# Altium schematic sheet S4V_Robot_Brain_V2.0_Schematic.SchDoc
size A3; SheetNumber: 1; SheetTotal: 1
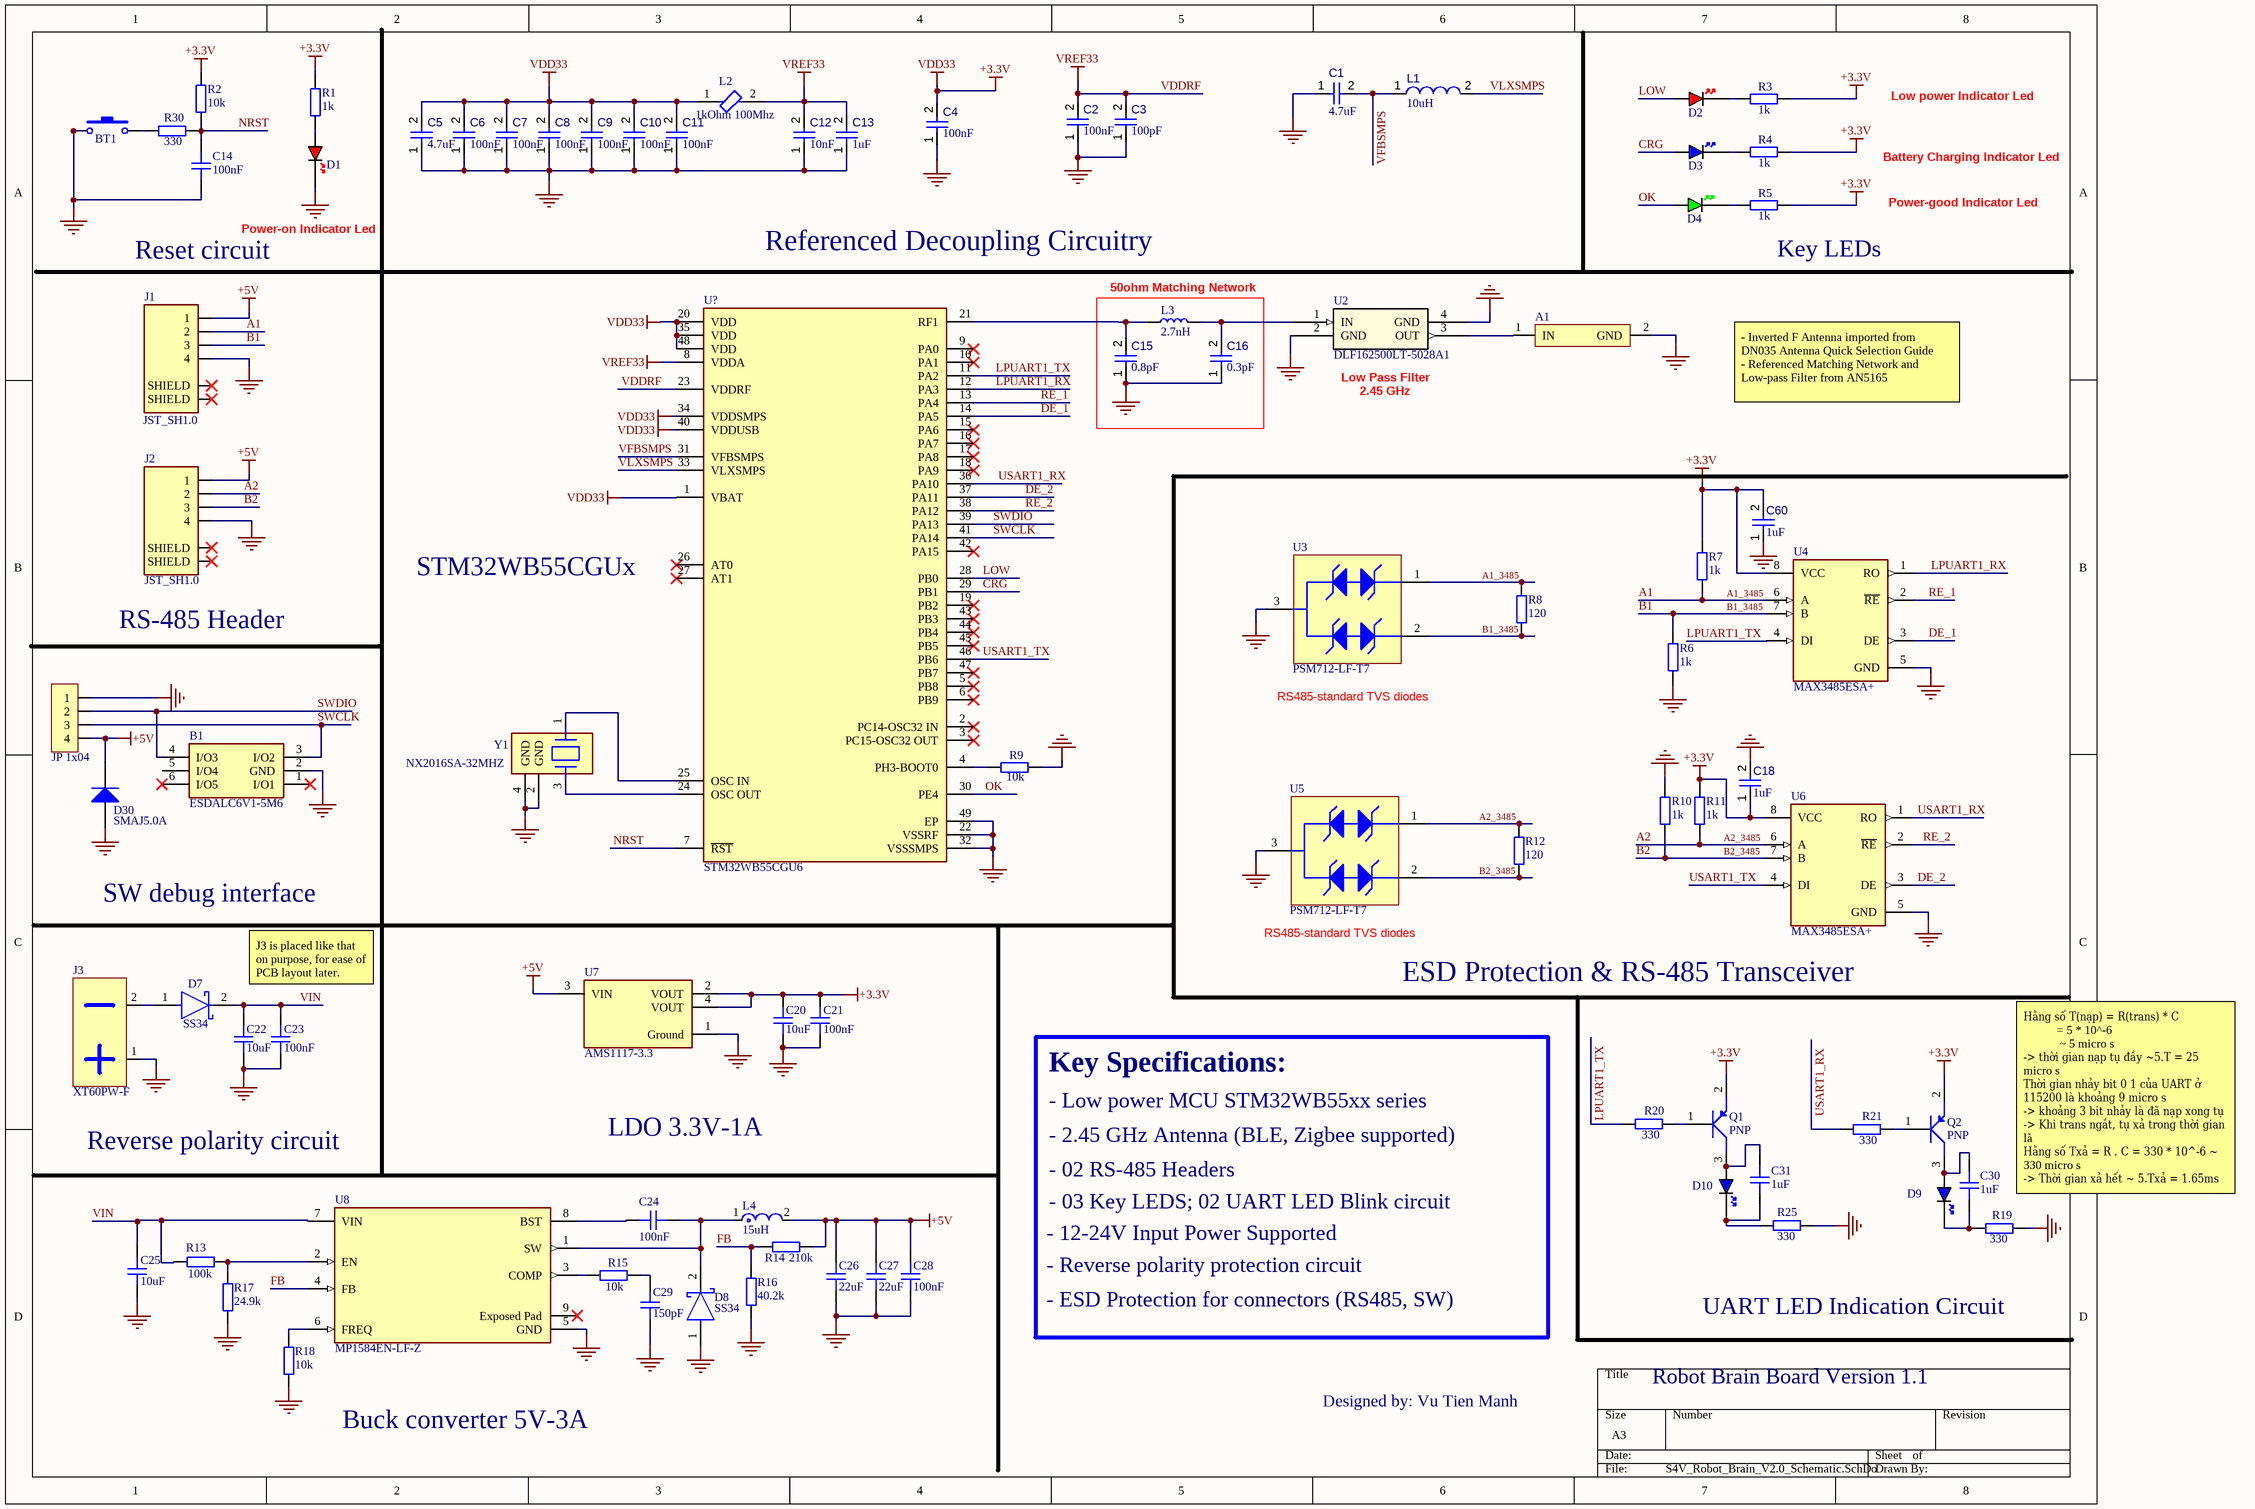
[diagram p0: S4V_Robot_Brain_V2.0_Schematic.SchDoc]

## Parts
A1  (no value)  [IFA_Antenna]
B1  ESDALC6V1-5M6  [ESDALC6V15M6]
BT1  Nut Nhan 2 Chan SMD 3x6x2.5  [Nut Nhan 2 Chan SMD 3x6x2.5]  (value not drawn)
C1  value 4.7uF  [CAPC1005X56X25LL10T15]  (hidden comment: Capacitor 0.1 uF +/- 5% 16 V 0402)
C2  value 100nF  [CAPC1005X56X25LL10T15]  (hidden comment: Capacitor 0.1 uF +/- 5% 16 V 0402)
C3  value 100pF  [CAPC1005X56X25LL10T15]  (hidden comment: Capacitor 0.1 uF +/- 5% 16 V 0402)
C4  value 100nF  [CAPC1005X56X25LL10T15]  (hidden comment: Capacitor 0.1 uF +/- 5% 16 V 0402)
C5  value 4.7uF  [CAPC1005X56X25LL10T15]  (hidden comment: Capacitor 0.1 uF +/- 5% 16 V 0402)
C6  value 100nF  [CAPC1005X56X25LL10T15]  (hidden comment: Capacitor 0.1 uF +/- 5% 16 V 0402)
C7  value 100nF  [CAPC1005X56X25LL10T15]  (hidden comment: Capacitor 0.1 uF +/- 5% 16 V 0402)
C8  value 100nF  [CAPC1005X56X25LL10T15]  (hidden comment: Capacitor 0.1 uF +/- 5% 16 V 0402)
C9  value 100nF  [CAPC1005X56X25LL10T15]  (hidden comment: Capacitor 0.1 uF +/- 5% 16 V 0402)
C10  value 100nF  [CAPC1005X56X25LL10T15]  (hidden comment: Capacitor 0.1 uF +/- 5% 16 V 0402)
C11  value 100nF  [CAPC1005X56X25LL10T15]  (hidden comment: Capacitor 0.1 uF +/- 5% 16 V 0402)
C12  value 10nF  [CAPC1005X56X25LL10T15]  (hidden comment: Capacitor 0.1 uF +/- 5% 16 V 0402)
C13  value 1uF  [CAPC1005X56X25LL10T15]  (hidden comment: Capacitor 0.1 uF +/- 5% 16 V 0402)
C14  100nF  [CAP_0603]
C15  value 0.8pF  [CAPC1005X56X25LL10T15]  (hidden comment: Capacitor 0.1 uF +/- 5% 16 V 0402)
C16  value 0.3pF  [CAPC1005X56X25LL10T15]  (hidden comment: Capacitor 0.1 uF +/- 5% 16 V 0402)
C18  value 1uF  [CAPC1608X90X35ML15T15]  (hidden comment: Capacitor 1uF +/- 10% 16V 0603)
C20  10uF  [CAP_0603]
C21  100nF  [CAP_0603]
C22  10uF  [CAP_0603]
C23  100nF  [CAP_0603]
C24  100nF  [CAP_0603]
C25  10uF  [CAP_0603]
C26  22uF  [CAP_0603]
C27  22uF  [CAP_0603]
C28  100nF  [CAP_0603]
C29  150pF  [CAP_0603]
C30  1uF  [CAP_0603]
C31  1uF  [CAP_0603]
C60  value 1uF  [CAPC1608X90X35ML15T15]  (hidden comment: Capacitor 1uF +/- 10% 16V 0603)
D1  RED  [LED_0603_RED]  (value not drawn)
D2  RED  [LED_0603_RED]  (value not drawn)
D3  BLUE  [LED_0603_BLUE]  (value not drawn)
D4  GREEN  [LED_0603_GREEN]  (value not drawn)
D7  SS34  [FP-403AE-MFG]
D8  SS34  [FP-403AE-MFG]
D9  BLUE  [LED_0603_BLUE]  (value not drawn)
D10  BLUE  [LED_0603_BLUE]  (value not drawn)
D30  SMAJ5.0A  [BOUR-SMA-2_V]
J1  JST_SH1.0  [JST_SM04B-SRSS-TB(LF)(SN)]
J2  JST_SH1.0  [JST_SM04B-SRSS-TB(LF)(SN)]
J3  XT60PW-F  [XT60PW-F]
JP?  JP 1x04  [JP 1x4 DT]
L1  value 10uH  [MURA-LQP15MN3N6B02D-2_M]  (hidden comment: LQP15MN3N6B02D)
L2  1kOhm 100Mhz  [FP-BLM15-0_05-IPC_A]
L3  2.7nH  [IND_0402]
L4  15uH  [FP-DS75LC-MFG]
Q1  PNP  [SOT-23-3]
Q2  PNP  [SOT-23-3]
R1  1k  [RES_0603]
R2  10k  [RES_0603]
R3  1k  [RES_0603]
R4  1k  [RES_0603]
R5  1k  [RES_0603]
R6  1k  [RES_0603]
R7  1k  [RES_0603]
R8  120  [RES_0603]
R9  10k  [RES_0402]
R10  1k  [RES_0603]
R11  1k  [RES_0603]
R12  120  [RES_0603]
R13  100k  [RES_0603]
R14  210k  [RES_0603]
R15  10k  [RES_0603]
R16  40.2k  [RES_0603]
R17  24.9k  [RES_0603]
R18  10k  [RES_0603]
R19  330  [RES_0603]
R20  330  [RES_0603]
R21  330  [RES_0603]
R25  330  [RES_0603]
R30  330  [RES_0603]
U2  DLF162500LT-5028A1  [DLF-4_1P6X0P8]
U3  PSM712-LF-T7  [PRKT-SOT23-3_V]
U4  MAX3485ESA+  [FP-S8-5-MFG]
U5  PSM712-LF-T7  [PRKT-SOT23-3_V]
U6  MAX3485ESA+  [FP-S8-5-MFG]
U7  AMS1117-3.3  [FP-AMS1117-IPC_C]
U8  MP1584EN-LF-Z  [FP-MP1584EN-LF-Z-MFG]
U?  STM32WB55CGU6  [FP-STM32WB55CGU6-MFG]
Y1  NX2016SA-32MHZ  [FP-NX2016SA-MFG]

## Blocks framed on the sheet
50ohm Matching Network: C15 C16 L3

## Nets
+3.3V: C4.2 C5.2 C6.2 C7.2 C8.2 C9.2 C10.2 C11.2 C18.1 C20.2 C21.2 C60.2 L2.1 Q1.2(E) Q2.2(E) R1.2 R2.1 R3.1 R4.1 R5.1 R7.1 R11.1 U4.8(VCC) U6.8(VCC) U7.2(VOUT) U7.4(VOUT) U?.1(VBAT) U?.20(VDD) U?.34(VDDSMPS) U?.35(VDD) U?.40(VDDUSB) U?.48(VDD)  [also labelled VDD33]
+5V: C26.1 C27.1 C28.1 D30.2(K) J1.1 J2.1 JP?.4 L4.2 R14.1 U7.3(VIN)
GND: A1.2(GND) B1.2(GND) BT1.1 C1.1 C2.1 C3.1 C4.1 C5.1 C6.1 C7.1 C8.1 C9.1 C10.1 C11.1 C12.1 C13.1 C14.2 C15.1 C16.1 C18.2 C20.1 C21.1 C22.1 C23.1 C25.2 C26.2 C27.2 C28.2 C29.1 C60.1 D1.K D8.1(A) D30.1(A) J1.4 J2.4 J3.1(V+) JP?.1 R6.1 R9.2 R10.1 R16.2 R17.2 R18.2 R19.2 R25.2 U2.2(GND) U2.4(GND) U3.3 U4.5(GND) U5.3 U6.5(GND) U7.1(Ground) U8.5(GND) U?.22(VSSRF) U?.32(VSSSMPS) U?.49(EP) Y1.2(GND) Y1.4(GND)
VDDRF: C2.2 C3.2 C12.2 C13.2 L2.2 U?.8(VDDA) U?.23(VDDRF)  [also labelled VREF33]
A1: J1.2 R7.2 R8.1 U3.1 U4.6(A)  [also labelled A1_3485]
A2: J2.2 R11.2 R12.1 U5.1 U6.6(A)  [also labelled A2_3485]
B1: J1.3 R6.2 R8.2 U3.2 U4.7(B)  [also labelled B1_3485]
B2: J2.3 R10.2 R12.2 U5.2 U6.7(B)  [also labelled B2_3485]
CRG: D3.A U?.29(PB1)
DE_1: U4.3(DE) U?.14(PA5)
DE_2: U6.3(DE) U?.37(PA11)
FB: R14.2 R16.1 U8.4(FB)
LOW: D2.A U?.28(PB0)
LPUART1_RX: U4.1(RO) U?.12(PA3)
LPUART1_TX: R20.1 U4.4(DI) U?.11(PA2)
NRST: C14.1 R2.2 R30.2 U?.7(~{RST})
OK: D4.A U?.30(PE4)
RE_1: U4.2(~{RE}) U?.13(PA4)
RE_2: U6.2(~{RE}) U?.38(PA12)
SWCLK: B1.3(I/O2) JP?.3 U?.41(PA14)
SWDIO: B1.4(I/O3) JP?.2 U?.39(PA13)
USART1_RX: R21.1 U6.1(RO) U?.36(PA10)
USART1_TX: U6.4(DI) U?.46(PB6)
VFBSMPS: C1.2 L1.1 U?.31(VFBSMPS)
VIN: C22.2 C23.2 C25.1 D7.2(C) R13.1 U8.7(VIN)
VLXSMPS: L1.2 U?.33(VLXSMPS)
NetA1_1: A1.1(IN) U2.3(OUT)
NetBT1_2: BT1.2 R30.1
NetC15_2: C15.2 L3.1 U?.21(RF1)
NetC16_2: C16.2 L3.2 U2.1(IN)
NetC24_1: C24.1 U8.8(BST)
NetC24_2: C24.2 D8.2(C) L4.1 U8.1(SW)
NetC29_2: C29.2 R15.1
NetC30_1: C30.1 D9.A Q2.3(C)
NetC30_2: C30.2 D9.K R19.1
NetC31_1: C31.1 D10.A Q1.3(C)
NetC31_2: C31.2 D10.K R25.1
NetD1_A: D1.A R1.1
NetD2_K: D2.K R3.2
NetD3_K: D3.K R4.2
NetD4_K: D4.K R5.2
NetD7_1: D7.1(A) J3.2(V-)
NetQ1_1: Q1.1(B) R20.2
NetQ2_1: Q2.1(B) R21.2
NetR9_1: R9.1 U?.4(PH3-BOOT0)
NetR13_2: R13.2 R17.1 U8.2(EN)
NetR15_2: R15.2 U8.3(COMP)
NetR18_1: R18.1 U8.6(FREQ)
NetU?_24: U?.24(OSC_OUT) Y1.3
NetU?_25: U?.25(OSC_IN) Y1.1

Not connected (* = marked no-connect by the designer): B1 1(I/O1)* 5(I/O4) 6(I/O5)*; J1 S1(SHIELD)* S2(SHIELD)*; J2 S1(SHIELD)* S2(SHIELD)*; U8 9(Exposed_Pad)*; U? 2(PC14-OSC32_IN)* 3(PC15-OSC32_OUT)* 5(PB8)* 6(PB9)* 9(PA0)* 10(PA1)* 15(PA6)* 16(PA7)* 17(PA8)* 18(PA9)* 19(PB2)* 26(AT0)* 27(AT1)* 42(PA15)* 43(PB3)* 44(PB4)* 45(PB5)* 47(PB7)*

## Notes on the sheet
- Low power Indicator Led
- Battery Charging Indicator Led
- Power-on Indicator Led
- Power-good Indicator Led
- Reset circuit
- Referenced Decoupling Circuitry
- (near R5) Key LEDs
- (near U2) Low Pass Filter
- (near U2) 2.45 GHz
- - Inverted F Antenna imported from DN035 Antenna Quick Selection Guide
  - Referenced Matching Network and Low-pass Filter from AN5165
- STM32WB55CGUx
- (near J2) RS-485 Header
- RS485-standard TVS diodes
- SW debug interface
- J3 is placed like that on purpose, for ease of PCB layout later.
- (near U5) RS485-standard TVS diodes
- (near U6) ESD Protection & RS-485 Transceiver
- Key Specifications:
- - Low power MCU STM32WB55xx series
- Reverse polarity circuit
- LDO 3.3V-1A
- - 02 RS-485 Headers
- - 2.45 GHz Antenna (BLE, Zigbee supported)
- Hằng số T(nạp) = R(trans) * C
  = 5 * 10^-6
  ~ 5 micro s
  -> thời gian nạp tụ đầy ~5.T = 25 micro s
  Thời gian nhảy bit 0 1 của UART ở 115200 là khoảng 9 micro s
  -> khoảng 3 bit nhảy là đã nạp xong tụ
  -> Khi trans ngắt, tụ xả trong thời gian là
  Hằng số Txả = R . C = 330 * 10^-6 ~ 330 micro s
  -> Thời gian xả hết ~ 5.Txả = 1.65ms
  -> Nếu truyền uart liên tục và ngắt ngắn thì sẽ thấy LED sáng rõ được
- - 12-24V Input Power Supported
- - 03 Key LEDS; 02 UART LED Blink circuit
- - Reverse polarity protection circuit
- - ESD Protection for connectors (RS485, SW)
- UART LED Indication Circuit
- Robot Brain Board Version 1.1
- Buck converter 5V-3A
- Designed by: Vu Tien Manh

## Library data of the parts
A1 = IFA_Antenna
B1 = ESDALC6V1-5M6: STMicroelectronics ESDALC6V1-5M6 Quint Uni-Directional TVS Diode, 30W peak, 6-Pin uQFN; Geometry.Height: 0.65mm; Manufacturer_Name: STMicroelectronics; Manufacturer_Part_Number: ESDALC6V1-5M6; Mouser Part Number: 511-ESDALC6V1-5M6; Mouser Price/Stock: https://www.mouser.co.uk/ProductDetail/STMicroelectronics/ESDALC6V1-5M6?qs=riAxU6JNBCsF7CaldDOuJw%3D%3D; Arrow Part Number: ESDALC6V1-5M6; Arrow Price/Stock: https://www.arrow.com/en/products/esdalc6v1-5m6/stmicroelectronics?utm_currency=USD&region=nac; Datasheet Link: https://www.st.com/resource/en/datasheet/esdalc6v1-5m6.pdf
BT1 = Nut Nhan 2 Chan SMD 3x6x2.5: Ma_Hang: MH001036; Ten: Nút Nhấn 2 Chân 3x6x2.5MM SMD
C1-C13 C15 C16 = CMP-001-00001-6: Chip Capacitor, 0.1 uF, +/- 5%, 16 V, 0402 (1005 Metric); Capacitor Type: Ceramic; Voltage Rating: 16V; Max Operating Temperature: 125°C; Min Operating Temperature: -55°C; Case/Package: 0402; Mounting Technology: SM; Pins: 2; Tolerance: 5%; RoHS Compliant: True
C14 C20-C31 = CAP_0603: Capacitor SMD 0603; Manufacturer: *; Manufacturer Part Number: *; Distributor Link: *; LCSC: *; Rating: *; Dielectric: *
C18 C60 = CMP-001-00004-6: Chip Capacitor, 1 uF, +/- 10%, 16 V, 0603 (1608 Metric); Capacitor Type: Ceramic; Mounting Technology: SM; RoHS Compliant: True; Min Operating Temperature: -55°C; Case/Package: 0603; Pins: 2; Voltage Rating: 16V; Max Operating Temperature: 125°C; Tolerance: 10%
D1 D2 = LED_0603_RED: LED 0603 RED SMD
D3 D9 D10 = LED_0603_BLUE: LED 0603 BLUE SMD
D4 = LED_0603_GREEN: LED 0603 GREEN SMD
D7 D8 = CMP-2000-04943-2: DIODE SCHOTTKY 40V 1A SMA; Manufacturer Part Number: SS14; Manufacturer: ON Semiconductor; Peak Reverse Current: 0.2mA; Max Junction Temp: +125°C; Standoff Height: 0.05mm; Max Surge Forward Current: 40A; Mouser Description: Schottky Diodes & Rectifiers SMA 40V 1.0A; RoHS: TRUE; Lead Free: Yes; Device Class L3: Schottky Diodes; Category: Diode; Automotive: No; Digikey Description: DIODE SCHOTTKY 40V 1A SMA; ComponentLink2Description: Datasheet; Device Class L2: Diodes; Height: 2.5mm; Temperature Range High: +125°C; ComponentLink2URL: https://www.onsemi.com/pub/Collateral/SS19-D.PDF; Device Class L1: Discrete Semiconductors; Package: 403AE; Octopart: https://octopart.com/ss14-on+semiconductor-29205033; Max Repetitive Reverse Voltage: 40V; Temperature Range Low: -65°C; Forward Current: 1A; Temperature: -65°C to +125°C
D30 = CMP-2000-07090-1: SMAJ Transient Voltage Suppressor Diode Series, 3.5 V, -55 to 150 degC, 2-Pin SMA, RoHS, Tape and Reel; Manufacturer: Bourns; EDA / CAD Models: DownloadfromAcceleratedDesigns; Unidirectional Channels: 1; Voltage - Breakdown (Min): 6.4V; Voltage - Reverse Standoff (Typ): 5V; Voltage - Clamping (Max) @ Ipp: 9.2V; Other Names: SMAJ5.0ABDKR; Type: Zener; Catalog Drawings: SMAJSeriesFootprintSMAJ,SMBJSeries; Featured Product: SMAJ/SMBJ/SMCJ/SMLJDiscreteTVSDiodes; Power - Peak Pulse: 400W; Current - Peak Pulse (10/1000µs): 43.5A; Power Line Protection: No; Online Catalog: SMAJSeries; Supplier Device Package: SMA(DO-214AC); Operating Temperature: -55°C~150°C(TJ); Package Description: 2-Pin Surface Mount Device, Body 4.315 x 2.605 mm; Datasheet URL: https://datasheet.ciiva.com/25624/0900766b8112213b-25624680.pdf; Manufacturer URL: http://www.bourns.com/; Datasheet Version: 08/2012; Series: SMAJ; Family: TVS-Diodes; Bidirectional Channels: -; Applications: GeneralPurpose; Package Reference: SMA-2; Standard Package: 1; Package / Case: DO-214AC,SMA; Category: CircuitProtection; RoHS Information: SMAJSeriesMaterialDeclaration; Mounting Technology: SurfaceMount; Capacitance @ Frequency: -; Packaging: Digi-Reel®; Mounting Type: SurfaceMount
J1 J2 = CMP-002-00071-1: Connector Header Surface Mount, Right Angle 4 position 0.039 (1.00mm); MF: JST Sales; Case/Package: None; MP: SM04B-SRSS-TB(LF)(SN); Source: SM04B-SRSS-TB(LF)(SN).SchLib; Value: *; Pins: 6; Component Type: Standard; Check_prices: https://www.snapeda.com/parts/SM04B-SRSS-TB(LF)(SN)/JST/view-part/?ref=eda; SnapEDA_Link: https://www.snapeda.com/parts/SM04B-SRSS-TB(LF)(SN)/JST/view-part/?ref=snap; Design Item ID: SM04B-SRSS-TB(LF)(SN)
J3 = XT60PW-F: XT60 horizontal female 2-pin AMASS; Manufacturer: AMASS; Manufacturer Part Number: XT60PW-F; Distributor Link: https://www.tme.eu/de/details/xt60pw-f/dc-steckverbinder/amass/
JP? = JP 1x4 2.54 Duc Thang: Cắm; Ten_Linh_Kien: Jump Đơn Đực 2.54MM 1x40P Thẳng 11MM; Don_Vi: Con; Ma_Hang: MH000903; Ghi_Chu: *; Kieu_Chan: *; Chung_Loai: Cắm
L1 = CMP-006-00010-6: Inductor, 500 MHz, 170 mA, 0.5 Ohm, -40 to 85 degC, 01005 (0402 Metric), RoHS, Tape and Reel; Manufacturer: Murata; Core Material: Ferrite; Self Resonant Frequency: 6GHz; Current Rating: 170mA; Shielding: Unshielded; Q Factor: 13; Datasheet URL: http://download.siliconexpert.com/pdfs/2016/4/21/8/25/31/646/mrt_/manual/797549851250188lqp15mn3n6b0223.pdf; Datasheet Version: Apr-16; Case/Package: 0402; Mounting Technology: SM; Min Operating Temperature: -40°C; RoHS Compliant: True; Package Description: 2-Pin Surface Mount Device, Body 1 x 0.5 mm; Max Operating Temperature: 85°C; Package Quantity: 10000; Package Reference: 0402; Packaging: TapeandReel
L2 = CMP-06046-002706-1: Chip Ferrite Bead, 0402, 1500Ω @ 100MHz, 1Ω, 25%, 190mA
L3 = IND_0402: Inductor SMD 0402
L4 = CMP-06042-011403-1: Shielded Wirewound Inductor 12uH 20% 2400mA 0.063Ω SMD; Saturation Current: 2.7A; DC Resistance (DCR): 63mR; Core Material: Ferrite; Current Rating: 2.4A; Test Frequency: 100kHz; Shielding: Shielded; Inductance: 12uH; Height - Seated (Max): 0.197inch; Max Operating Temperature: 85°C; Case/Package: Nonstandard; Resistor Type: Wirewound; Tolerance: 20%; Width: 0.299inch; Mount: Surface Mount; Length: 0.299inch; Packaging: Tape and Reel; Min Operating Temperature: -40°C
Q1 Q2 = BJT_PNP_BEC_SOT233: Transistor BJT PNP SOT-23-3 Package Base=1 Emitter=2 Collector=3
R1-R8 R10-R21 R25 R30 = RES_0603: Resistor SMD 0603; Manufacturer: *; Manufacturer Part Number: *; Distributor Link: *; LCSC: *
R9 = RES_0402: Resistor SMD 0402; Manufacturer: *; Manufacturer Part Number: *; Distributor Link: *; LCSC: *
U2 = DLF162500LT-5028A1: Description; Manufacturer_Name: TDK; Copyright: Copyright (C) 2025 Ultra Librarian. All rights reserved.; Manufacturer_Part_Number: DLF162500LT-5028A1; RefDes: RefDes; Type: Type
U3 U5 = CMP-2000-07553-1: TVS Array - Asymmetrical Data Line Protector, 600 W, 7.5 V, -55 to 150 degC, 3-Pin SOT23, RoHS, Tape and Reel; Manufacturer: Protek Devices; Min Breakdown Voltage: 7.5V; Direction: Bidirectional; Capacitance: 75pF; Current: 20uA; Power Dissipation: 600W; Working Voltage: 7V; Voltage: 12V; Case\/Package: SOT-23; Clamping Voltage: 17V; Element Configuration: Dual; Mounting Technology: SurfaceMount; RoHSCompliant: True; Radiation Hardening: No; Depth: 1.4mm; Lead Free: LeadFree; Package Description: 3-Pin Small Outline Transistor, Body 2.92 x 1.3 mm, Pitch 0.94 mm; Max Operating Temperature: 150degC; Length: 3.04mm; Manufacturer URL: http://www.protekdevices.com/; Min Operating Temperature: -55degC; Leakage Current: 20uA; Datasheet URL: www.protekdevices.com/xyz/documents/datasheets/psm712.pdf; Packaging: TapeandReel; Datasheet Version: 10/2013; Package Reference: SOT23-3; Number of Pins: 3
U4 U6 = CMP-05679-000038-1: IC TXRX RS485/422 10MBPS 8SOIC; Manufacturer Part Number: MAX3485EESA+; Manufacturer: Maxim Integrated; Number Of Receivers: 1; Simplex Duplex: Half Duplex; Data Rate: 15Mbits/s; Interface: RS-485,RS-422; Max Supply Voltage: 3.6V; Nominal Supply Current: 0.95-1.1mA; Min Supply Voltage: 3V; Standoff Height: 0.1mm; Mouser Description: RS-422/RS-485 Interface IC 3.3V 12Mbps Transceiver; Lead Free: Yes; Footprint Url: https://pdfserv.maximintegrated.com/land_patterns/90-0096.PDF; Device Class L1: Integrated Circuits (ICs); Device Class L3: RS-232 / RS-422 / RS-485 Interface ICs; RoHS: TRUE; Height: 1.75mm; ComponentLink2URL: https://datasheets.maximintegrated.com/en/ds/MAX3483E-MAX3491E.pdf; Temperature Range High: +85°C; Temperature: -40°C to +85°C; Number Of Transmitters: 1; Device Class L2: Interface ICs; Octopart: https://octopart.com/max3485eesa%2B-maxim+integrated-39731903; ComponentLink2Description: Datasheet; Category: IC; Digikey Description: IC TXRX RS485/422 10MBPS 8SOIC; Automotive: No; Temperature Range Low: -40°C; Package: S8-5
U7 = CMP-209535-000001-1: LDO Voltage Regulators 1A, 3.3V; Manufacturer: Advanced Monolithic Systems; Dropout Voltage: 1.1V; Output Type: Fixed; Nominal Supply Current: 5mA; Max Power Dissipation: 1.2W; Max Supply Voltage: 15V; Number Of Outputs: 1; Standoff Height: 0.64mm; Max Junction Temp: +125°C; Height: 1.8mm; Package: AMS1117; Device Class L2: Power Management ICs; ComponentLink2Description: Datasheet; ComponentLink2URL: http://www.advanced-monolithic.com/pdf/ds1117.pdf; Category: IC; RoHS: TRUE; Automotive: No; Device Class L1: Integrated Circuits (ICs); Output Current: 1A; Device Class L3: Voltage Regulators - Linear; Temperature: -40°C to +125°C; Output Voltage: 3.3V; Manufacturer Part Number: AMS1117-3.3; Temperature Range Low: -40°C; Octopart: https://octopart.com/ams1117-3.3-advanced+monolithic+systems-25899300; Lead Free: Yes; Ipc Land Pattern Name: SOT229P700X180-4; Temperature Range High: +125°C
U8 = CMP-57379-000006-1: IC REG BUCK ADJ 3A; Manufacturer: Monolithic Power Systems; Output Type: AdjustableProgrammable; Nominal Supply Current: 100uA; Switching Frequency: 100-1500kHz; Max Power Dissipation: 2.5W; Output Voltage: 0.8-25V; Max Junction Temp: +125°C; Min Supply Voltage: 4.5V; Max Supply Voltage: 28V; Number Of Outputs: 1; Standoff Height: 0mm; ComponentLink2URL: https://www.monolithicpower.com/en/documentview/productdocument/index/doc_url/L01QMTU4NF9yMS4wLnBkZg%3D%3D/release_date/MjAwOS0wNC0wOSAwMDowMDowMA%3D%3D/; Lead Free: Yes; Package: MP1584EN-LF-Z; Temperature Range Low: -20°C; Temperature: -20°C to +125°C; Height: 1.7mm; Ambient Temperature Range Low: -20°C; RoHS: TRUE; Automotive: No; Ipc Land Pattern Name: SOIC127P600X150-8; Ambient Temperature Range High: +85°C; Device Class L2: Power Management ICs; ComponentLink2Description: Datasheet; Manufacturer Part Number: MP1584EN-LF-Z; Device Class L3: Voltage Regulators - Switching; Octopart: https://octopart.com/mp1584en-lf-z-monolithic+power+systems-18629680; Category: IC; Output Current: 3A; Digikey Description: IC REG BUCK ADJ 3A; Temperature Range High: +125°C; Device Class L1: Integrated Circuits (ICs); Switching Topology: Buck
U? = CMP-12105-000013-1: ULTRA-LOW-POWER DUAL CORE ARM CO; Manufacturer: STMicroelectronics; Number Of Cores: 1; Number Of I2C Channels: 2; Interface: I2C,SPI,UART,USART,2-Wire,USB,IrDA,Other; Core Architecture: ARM Cortex-M4; Data Bus Width: 32bits; Memory Size: 1MBytes; Number Of Pwm Channels: 14; Max Supply Voltage: 3.6V; Standoff Height: 0mm; Number Of Timers/Counters: 6; Frequency: 64MHz; Max Junction Temp: +105°C; Number Of I/Os: 30; Min Supply Voltage: 1.71V; Number Of Adc Channels: 13; Ram Size: 256KBytes; Memory Type: FLASH; Octopart: https://octopart.com/stm32wb55cgu6-stmicroelectronics-98750847; Temperature Range High: +105°C; RoHS: TRUE; Number Of Spi Channels: 1; Category: IC; Device Class L1: Integrated Circuits (ICs); Lead Free: Yes; Height: 0.65mm; Number Of A/D Converters: 1; Package: UFQFPN48; Number Of Usb Channels: 1; Number Of Uart Channels: 2; Temperature Range Low: -40°C; Ambient Temperature Range Low: -40°C; Device Class L3: Microcontrollers; Manufacturer Part Number: STM32WB55CGU6; Temperature: -40°C to +105°C; ComponentLink2URL: https://www.st.com/resource/en/datasheet/stm32wb55cg.pdf; Device Class L2: Embedded Processors and Controllers; Digikey Description: ULTRA-LOW-POWER DUAL CORE ARM CO; ComponentLink2Description: Datasheet; Ambient Temperature Range High: +85°C; Automotive: No
Y1 = CMP-200220-000017-1: CRYSTAL 32.0000MHZ 8PF SMD; Frequency: 32MHz; ESR (Equivalent Series Resistance): 60R; Ratings: AEC-Q200; Mount: Surface Mount; Case/Package: SMD/SMT; Packaging: Tape and Reel; Load Capacitance: 8pF; Min Operating Temperature: -40°C; Max Operating Temperature: 125°C